# EAGLE design PropGame_DevBoard_schema (EAGLE 6.3)
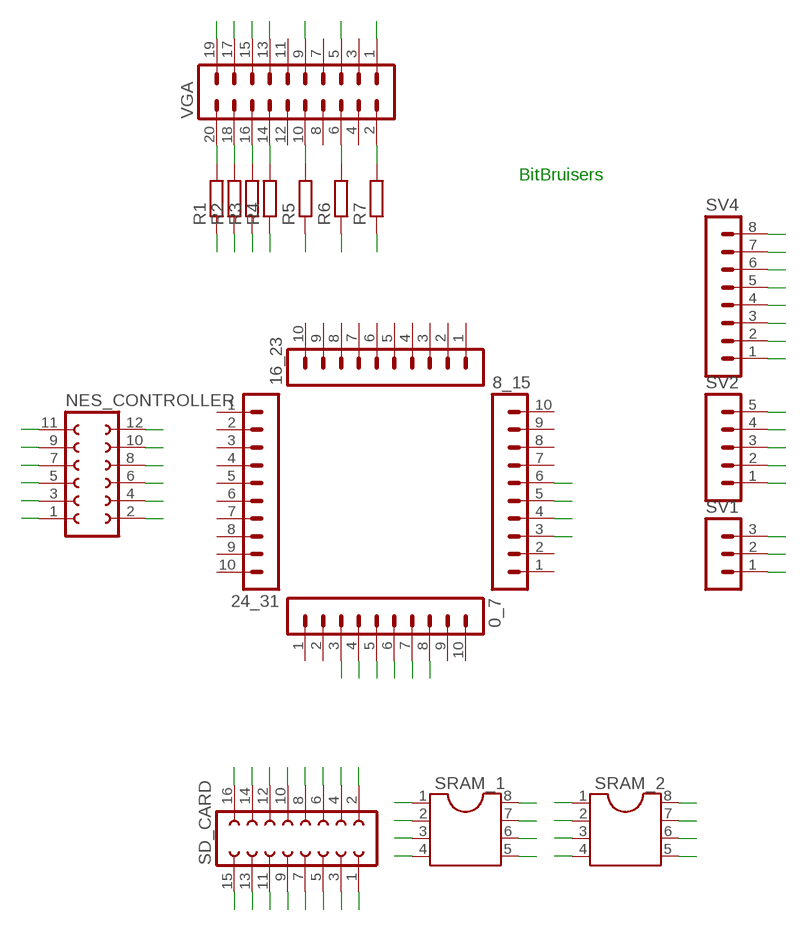
[diagram p0: schematic, sheet 1]

## Parts
0_7  MA10-1  [MA10-1]
8_15  MA10-1  [MA10-1]
16_23  MA10-1  [MA10-1]
24_31  MA10-1  [MA10-1]
NES_CONTROLLER  FE06-2  [FE06-2]
R1  R-EU_0204/7  [0204/7]
R2  R-EU_0204/7  [0204/7]
R3  R-EU_0204/7  [0204/7]
R4  R-EU_0204/7  [0204/7]
R5  R-EU_0204/7  [0204/7]
R6  R-EU_0204/7  [0204/7]
R7  R-EU_0204/7  [0204/7]
SD_CARD  FE08-2  [FE08-2]
SRAM_1  DIL8  [DIL08]
SRAM_2  DIL8  [DIL08]
SV1  MA03-1  [MA03-1]
SV2  MA05-1  [MA05-1]
SV4  MA08-1  [MA08-1]
VGA  MA10-2  [MA10-2]

## Nets
3V3: SD_CARD.13 SD_CARD.14 SRAM_1.8 SRAM_2.8 SV1.1 SV1.2 SV1.3
5V: NES_CONTROLLER.3 NES_CONTROLLER.4 SD_CARD.11 SD_CARD.12 SV4.1 SV4.2 SV4.3
CLK: 8_15.3 NES_CONTROLLER.11 NES_CONTROLLER.12
CS_1: 0_7.6 SD_CARD.9 SD_CARD.10
CS_2: 0_7.7 SRAM_1.1
CS_3: 0_7.8 SRAM_2.1
DATA1: 8_15.5 NES_CONTROLLER.7 NES_CONTROLLER.8
DATA2: 8_15.6 NES_CONTROLLER.5 NES_CONTROLLER.6
GND: NES_CONTROLLER.1 NES_CONTROLLER.2 SD_CARD.1 SD_CARD.2 SD_CARD.15 SD_CARD.16 SRAM_1.4 SRAM_2.4 SV2.1 SV2.2 SV2.3 SV2.4 SV2.5 SV4.4 SV4.5 SV4.6 SV4.7 SV4.8
LATCH: 8_15.4 NES_CONTROLLER.9 NES_CONTROLLER.10
MISO: 0_7.5 SD_CARD.3 SD_CARD.4 SRAM_1.2 SRAM_2.2
MOSI: 0_7.4 SD_CARD.7 SD_CARD.8 SRAM_1.5 SRAM_2.5
N$1: R1.2 VGA.20
N$2: R2.2 VGA.18
N$3: R3.2 VGA.16
N$4: R4.2 VGA.14
N$5: R5.2 VGA.10
N$6: R6.2 VGA.6
N$7: R7.2 VGA.2
N$15: SRAM_1.7
N$19: SRAM_2.3
N$21: SRAM_2.7
N$26: SRAM_1.3
SCK: 0_7.3 SD_CARD.5 SD_CARD.6 SRAM_1.6 SRAM_2.6
W_1: R1.1 VGA.19
W_2: R2.1 VGA.17
W_3: R3.1 VGA.15
W_4: R4.1 VGA.13
W_5: R5.1 VGA.9
W_6: R6.1 VGA.5
W_7: R7.1 VGA.1
Unconnected: 0_7.1 0_7.2 0_7.9 0_7.10 8_15.1 8_15.2 8_15.7 8_15.8 8_15.9 8_15.10 16_23.1 16_23.2 16_23.3 16_23.4 16_23.5 16_23.6 16_23.7 16_23.8 16_23.9 16_23.10 24_31.1 24_31.2 24_31.3 24_31.4 24_31.5 24_31.6 24_31.7 24_31.8 24_31.9 24_31.10 VGA.3 VGA.4 VGA.7 VGA.8 VGA.11 VGA.12

## Notes on the sheet
- BitBruisers

## Library data of the parts
0_7 8_15 16_23 24_31 = con-lstb:MA10-1: PIN HEADER; OC_FARNELL: unknown; OC_NEWARK: unknown
NES_CONTROLLER = con-lsta:FE06-2: FEMALE HEADER; OC_FARNELL: unknown; OC_NEWARK: unknown
R1-R7 = resistor:R-EU_: RESISTOR, European symbol
SD_CARD = con-lsta:FE08-2: FEMALE HEADER; OC_FARNELL: unknown; OC_NEWARK: unknown
SRAM_1 SRAM_2 = ic-package:DIL8: Dual In Line / Socket
SV1 = con-lstb:MA03-1: PIN HEADER; OC_FARNELL: unknown; OC_NEWARK: unknown
SV2 = con-lstb:MA05-1: PIN HEADER; OC_FARNELL: unknown; OC_NEWARK: unknown
SV4 = con-lstb:MA08-1: PIN HEADER; OC_FARNELL: unknown; OC_NEWARK: unknown
VGA = con-lstb:MA10-2: PIN HEADER; OC_FARNELL: unknown; OC_NEWARK: unknown

## Board
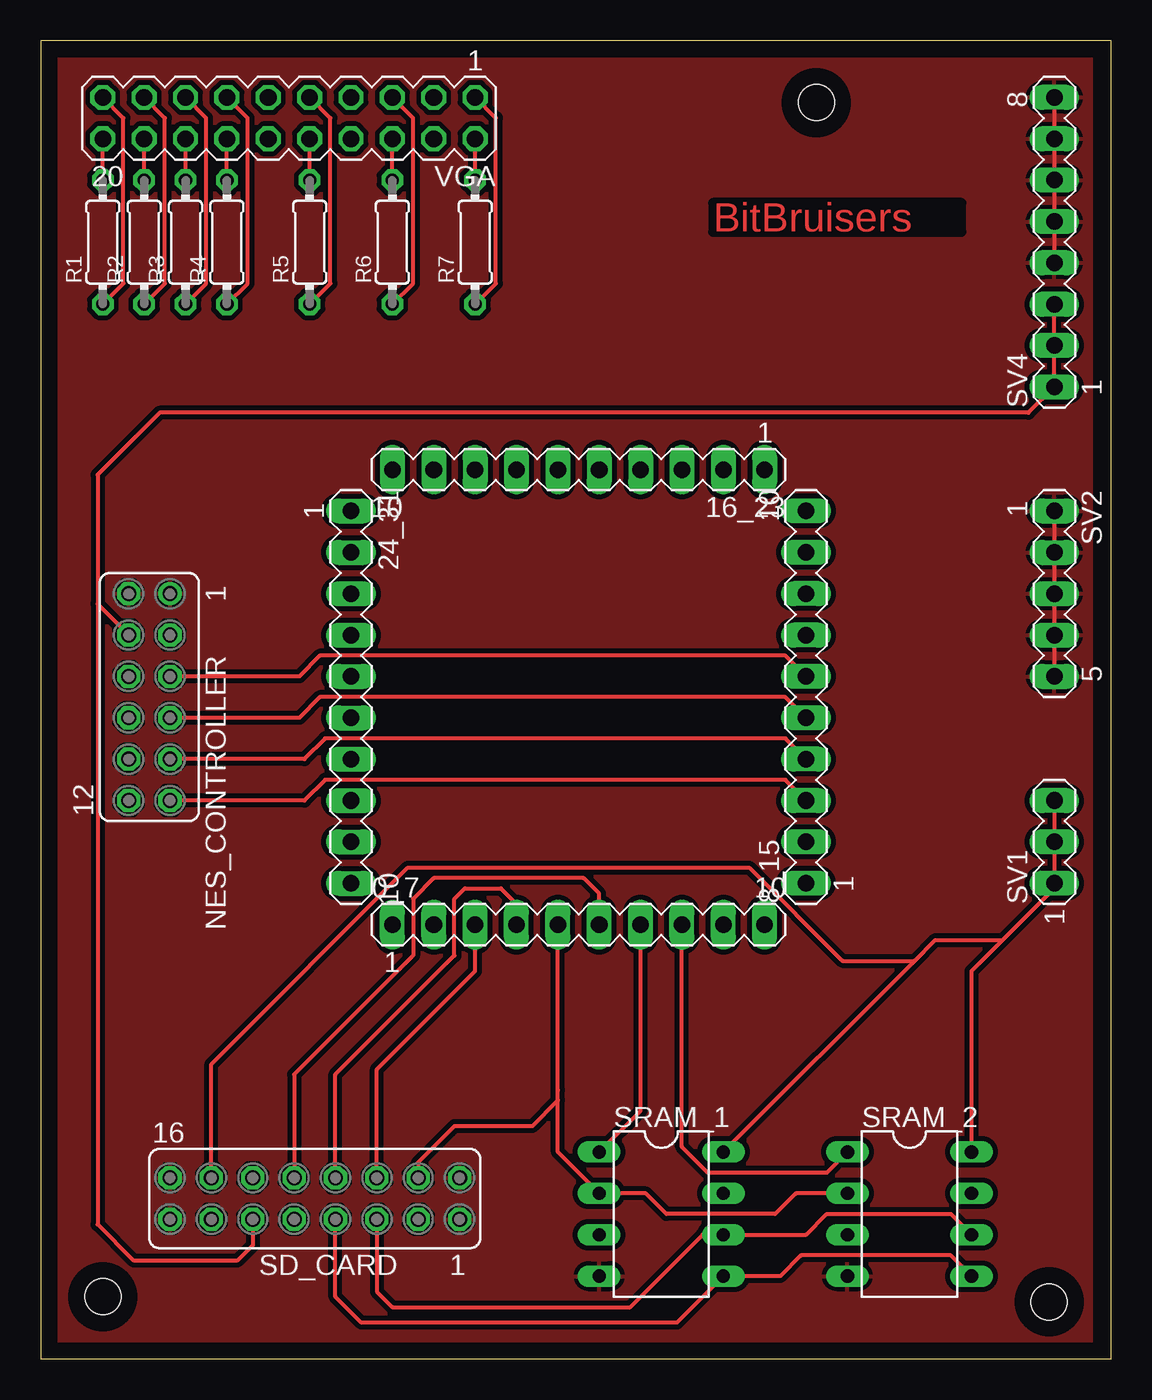
[diagram p1: board, top side]
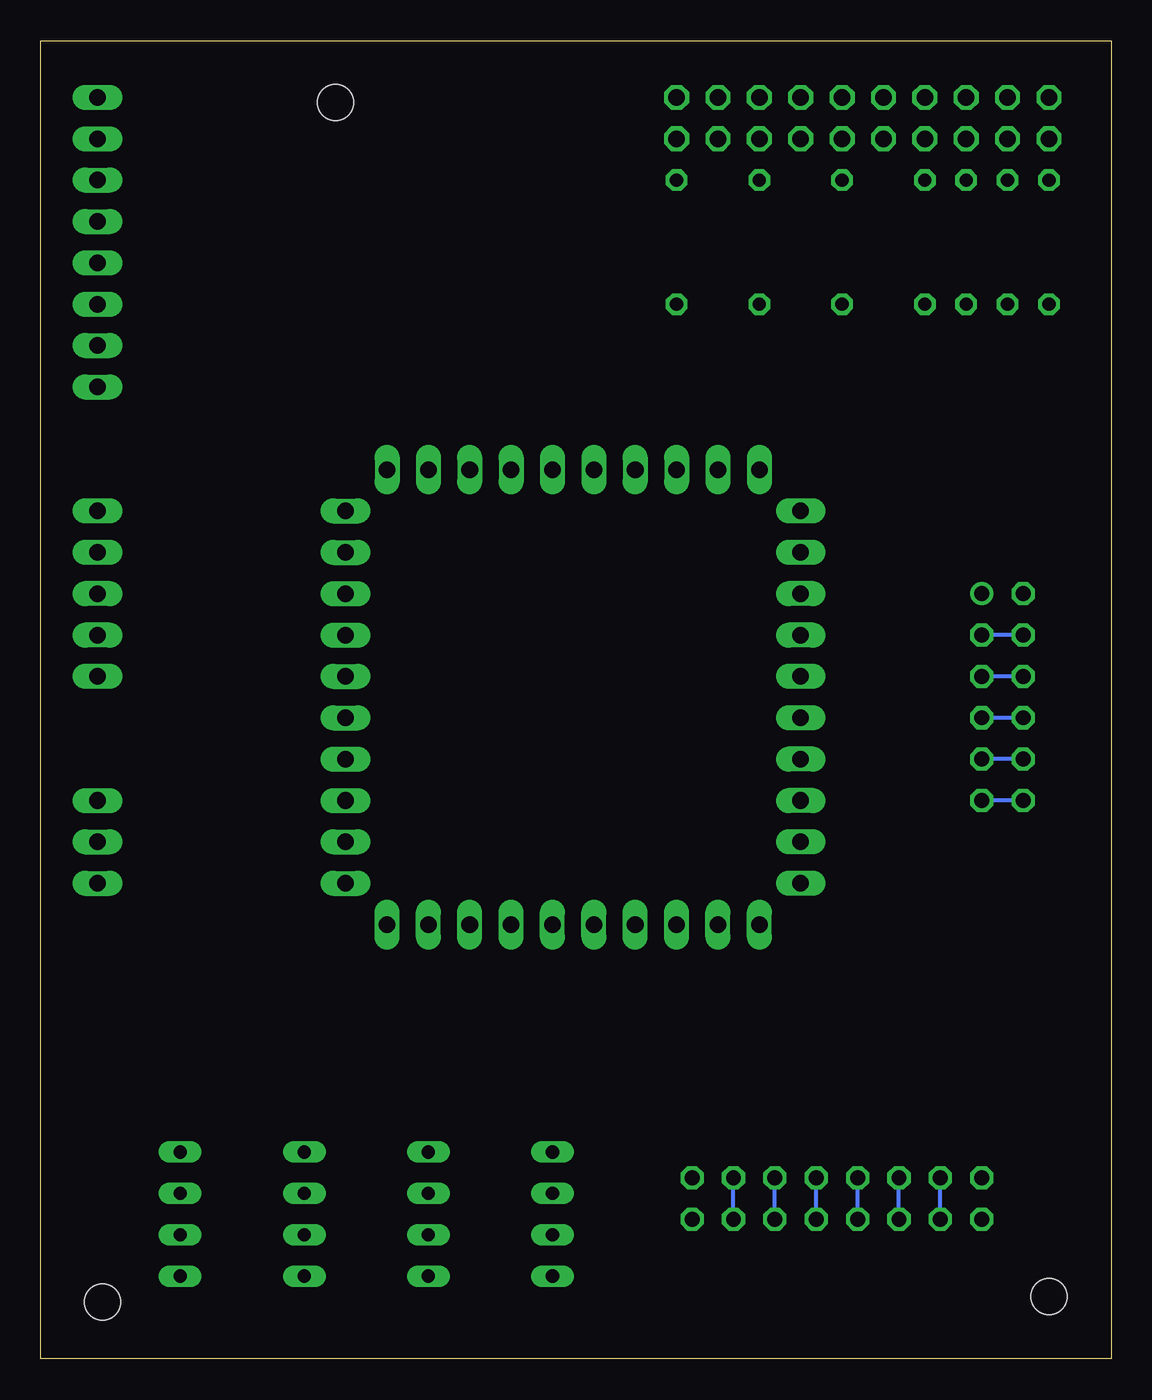
[diagram p2: board, bottom side, seen from below]

Size 65.71 x 80.95 mm. Coordinates in mm from the lower left corner, seen from the top.
Outline: 0,0 65.71,0 65.71,80.95 0,80.95 0,0
Copper layers (1*16): Top 0.035mm / dielectric 1.5mm / Bottom 0.035mm
Design rules "default *": minimum track width 10mil, minimum drill 24mil, track to track 12mil, track to pad 12mil, pad to pad 12mil, via to via 12mil, smd to smd 12mil, copper to edge 40mil, drill to drill 8mil, minimum pad ring 10mil, minimum via ring 8mil, stop-mask expansion 4mil, vias tented up to drill 0mil, thermal gap 10mil
Holes 2.2 mm at 3.81,3.81 61.91,3.49 47.62,77.15

### Footprints (pad centres in the part's own frame; a part is rotated, then mirrored left to right if it is on the bottom)
MA10-1 = drill 1.016 long: 1 -11.43,0; 2 -8.89,0; 3 -6.35,0; 4 -3.81,0; 5 -1.27,0; 6 1.27,0; 7 3.81,0; 8 6.35,0; 9 8.89,0; 10 11.43,0
FE06-2 = drill 0.914: 1 -6.35,1.27 | drill 0.914 octagon: 2 -6.35,-1.27; 3 -3.81,1.27; 4 -3.81,-1.27; 5 -1.27,1.27; 6 -1.27,-1.27; 7 1.27,1.27; 8 1.27,-1.27; 9 3.81,1.27; 10 3.81,-1.27; 11 6.35,1.27; 12 6.35,-1.27
0204/7 = drill 0.813 octagon: 1 -3.81,0; 2 3.81,0
FE08-2 = drill 0.914 octagon: 1 -8.89,1.27; 2 -8.89,-1.27; 3 -6.35,1.27; 4 -6.35,-1.27; 5 -3.81,1.27; 6 -3.81,-1.27; 7 -1.27,1.27; 8 -1.27,-1.27; 9 1.27,1.27; 10 1.27,-1.27; 11 3.81,1.27; 12 3.81,-1.27; 13 6.35,1.27; 14 6.35,-1.27; 15 8.89,1.27; 16 8.89,-1.27
DIL08 = drill 0.813 long: 1 -3.81,-3.81; 2 -1.27,-3.81; 3 1.27,-3.81; 4 3.81,-3.81; 5 3.81,3.81; 6 1.27,3.81; 7 -1.27,3.81; 8 -3.81,3.81
MA03-1 = drill 1.016 long: 1 -2.54,0; 2 0,0; 3 2.54,0
MA05-1 = drill 1.016 long: 1 -5.08,0; 2 -2.54,0; 3 0,0; 4 2.54,0; 5 5.08,0
MA08-1 = drill 1.016 long: 1 -8.89,0; 2 -6.35,0; 3 -3.81,0; 4 -1.27,0; 5 1.27,0; 6 3.81,0; 7 6.35,0; 8 8.89,0
MA10-2 = drill 1.016 octagon: 1 -11.43,-1.27; 2 -11.43,1.27; 3 -8.89,-1.27; 4 -8.89,1.27; 5 -6.35,-1.27; 6 -6.35,1.27; 7 -3.81,-1.27; 8 -3.81,1.27; 9 -1.27,-1.27; 10 -1.27,1.27; 11 1.27,-1.27; 12 1.27,1.27; 13 3.81,-1.27; 14 3.81,1.27; 15 6.35,-1.27; 16 6.35,1.27; 17 8.89,-1.27; 18 8.89,1.27; 19 11.43,-1.27; 20 11.43,1.27

### Placement (x,y rotation side)
0_7  33.02,26.67 0 top
8_15  46.99,40.64 90 top
16_23  33.02,54.61 180 top
24_31  19.05,40.64 270 top
NES_CONTROLLER  6.67,40.64 270 top
R1  3.81,68.58 90 top
R2  6.35,68.58 90 top
R3  8.89,68.58 90 top
R4  11.43,68.58 90 top
R5  16.51,68.58 90 top
R6  21.59,68.58 90 top
R7  26.67,68.58 90 top
SD_CARD  16.83,9.84 180 top
SRAM_1  38.1,8.89 270 top
SRAM_2  53.34,8.89 270 top
SV1  62.23,31.75 90 top
SV2  62.23,46.99 270 top
SV4  62.23,68.58 90 top
VGA  15.24,76.2 180 top

### Tracks (layer width: path | path; a pad name or v marks a point on that pad's centre or on a via)
3V3
  Top 0.254: SV1.3 SV1.2 SV1.1 62.23,28.89 59.05,25.72 | SRAM_2.8 57.15,23.81 59.05,25.72 | SRAM_1.8 53.66,24.45 | 53.66,24.45 54.93,25.72 59.05,25.72 | SD_CARD.14 10.48,18.1 22.54,30.16 43.5,30.16 49.21,24.45 53.66,24.45
  Bottom 0.254: SD_CARD.13 SD_CARD.14
5V
  Top 0.254: SV4.3 SV4.2 SV4.1 60.64,58.1 7.3,58.1 3.49,54.29 3.49,46.35 | NES_CONTROLLER.4 3.49,46.35 | 3.49,46.35 3.49,8.26 5.71,6.03 12.06,6.03 13.02,6.99 SD_CARD.11
  Bottom 0.254: NES_CONTROLLER.4 NES_CONTROLLER.3 | SD_CARD.11 SD_CARD.12
CLK
  Top 0.254: 8_15.3 45.72,35.56 17.46,35.56 16.19,34.29 NES_CONTROLLER.11
  Bottom 0.254: NES_CONTROLLER.12 NES_CONTROLLER.11
CS_1
  Top 0.254: 0_7.6 34.29,28.57 33.34,29.53 24.13,29.53 22.86,28.26 22.86,24.77 15.56,17.46 SD_CARD.10
  Bottom 0.254: SD_CARD.9 SD_CARD.10
CS_2
  Top 0.254: SRAM_1.1 36.83,15.24 0_7.7
CS_3
  Top 0.254: SRAM_2.1 48.26,11.43 40.96,11.43 39.37,13.02 0_7.8
DATA1
  Top 0.254: 8_15.5 45.72,40.64 17.14,40.64 15.88,39.37 NES_CONTROLLER.7
  Bottom 0.254: NES_CONTROLLER.8 NES_CONTROLLER.7
DATA2
  Top 0.254: 8_15.6 45.72,43.18 17.14,43.18 15.88,41.91 NES_CONTROLLER.5
  Bottom 0.254: NES_CONTROLLER.6 NES_CONTROLLER.5
GND
  Top 0.254: SV4.8 SV4.7 SV4.6 SV4.5 SV4.4 | SV2.1 SV2.2 SV2.3 SV2.4 SV2.5
  pour Top: 0,80.01 64.45,80.01 64.45,0 0,0
LATCH
  Top 0.254: 8_15.4 45.72,38.1 17.46,38.1 16.19,36.83 NES_CONTROLLER.9
  Bottom 0.254: NES_CONTROLLER.10 NES_CONTROLLER.9
MISO
  Top 0.254: SRAM_2.2 46.35,10.16 45.09,8.89 38.42,8.89 37.15,10.16 SRAM_1.2 31.75,12.7 31.75,15.88 | 0_7.5 31.75,16.51 31.75,15.88 | SD_CARD.4 23.18,12.06 25.4,14.29 30.16,14.29 31.75,15.88
  Bottom 0.254: SD_CARD.3 SD_CARD.4
MOSI
  Top 0.254: SRAM_2.5 55.88,6.35 46.67,6.35 45.4,5.08 SRAM_1.5 39.05,2.22 19.68,2.22 18.1,3.81 SD_CARD.7 | SD_CARD.8 18.1,17.46 25.4,24.77 25.4,28.26 26.04,28.89 28.26,28.89 29.21,27.94 0_7.4
  Bottom 0.254: SD_CARD.7 SD_CARD.8
N$1
  Top 0.254: R1.2 VGA.20
N$2
  Top 0.254: R2.2 VGA.18
N$3
  Top 0.254: R3.2 VGA.16
N$4
  Top 0.254: R4.2 VGA.14
N$5
  Top 0.254: R5.2 VGA.10
N$6
  Top 0.254: R6.2 VGA.6
N$7
  Top 0.254: R7.2 VGA.2
SCK
  Top 0.254: SRAM_2.6 55.88,8.89 48.26,8.89 46.99,7.62 SRAM_1.6 40.64,7.62 36.2,3.17 21.59,3.17 20.64,4.13 SD_CARD.5 | SD_CARD.6 20.64,17.78 26.67,23.81 0_7.3
  Bottom 0.254: SD_CARD.5 SD_CARD.6
W_1
  Top 0.254: R1.1 5.08,66.04 5.08,76.2 VGA.19
W_2
  Top 0.254: R2.1 7.62,66.04 7.62,76.2 VGA.17
W_3
  Top 0.254: R3.1 10.16,66.04 10.16,76.2 VGA.15
W_4
  Top 0.254: R4.1 12.7,66.04 12.7,76.2 VGA.13
W_5
  Top 0.254: R5.1 17.78,66.04 17.78,76.2 VGA.9
W_6
  Top 0.254: R6.1 22.86,66.04 22.86,76.2 VGA.5
W_7
  Top 0.254: R7.1 27.94,66.04 27.94,76.2 VGA.1

### Text on the board
Top: BitBruisers